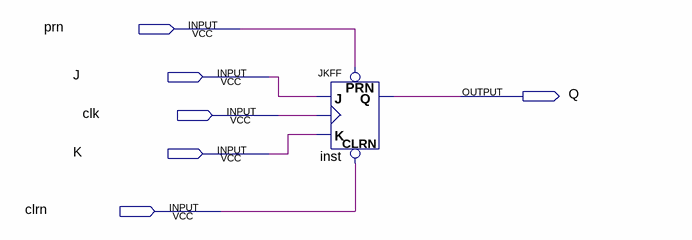
[diagram p0: schematic sheet]
// Quartus schematic jkff_altera.bdf as structural Verilog: 1 symbols, 6 pins
module jkff_altera (
  input  prn,
  input  J,
  input  clk,
  input  K,
  input  clrn,
  output Q
);

  JKFF inst (.PRN(prn), .CLRN(clrn), .K(K), .J(J), .CLK(clk), .Q(Q));
endmodule
